# Altium schematic sheet Main.SchDoc
size A; SheetNumber: 2; SheetTotal: 3
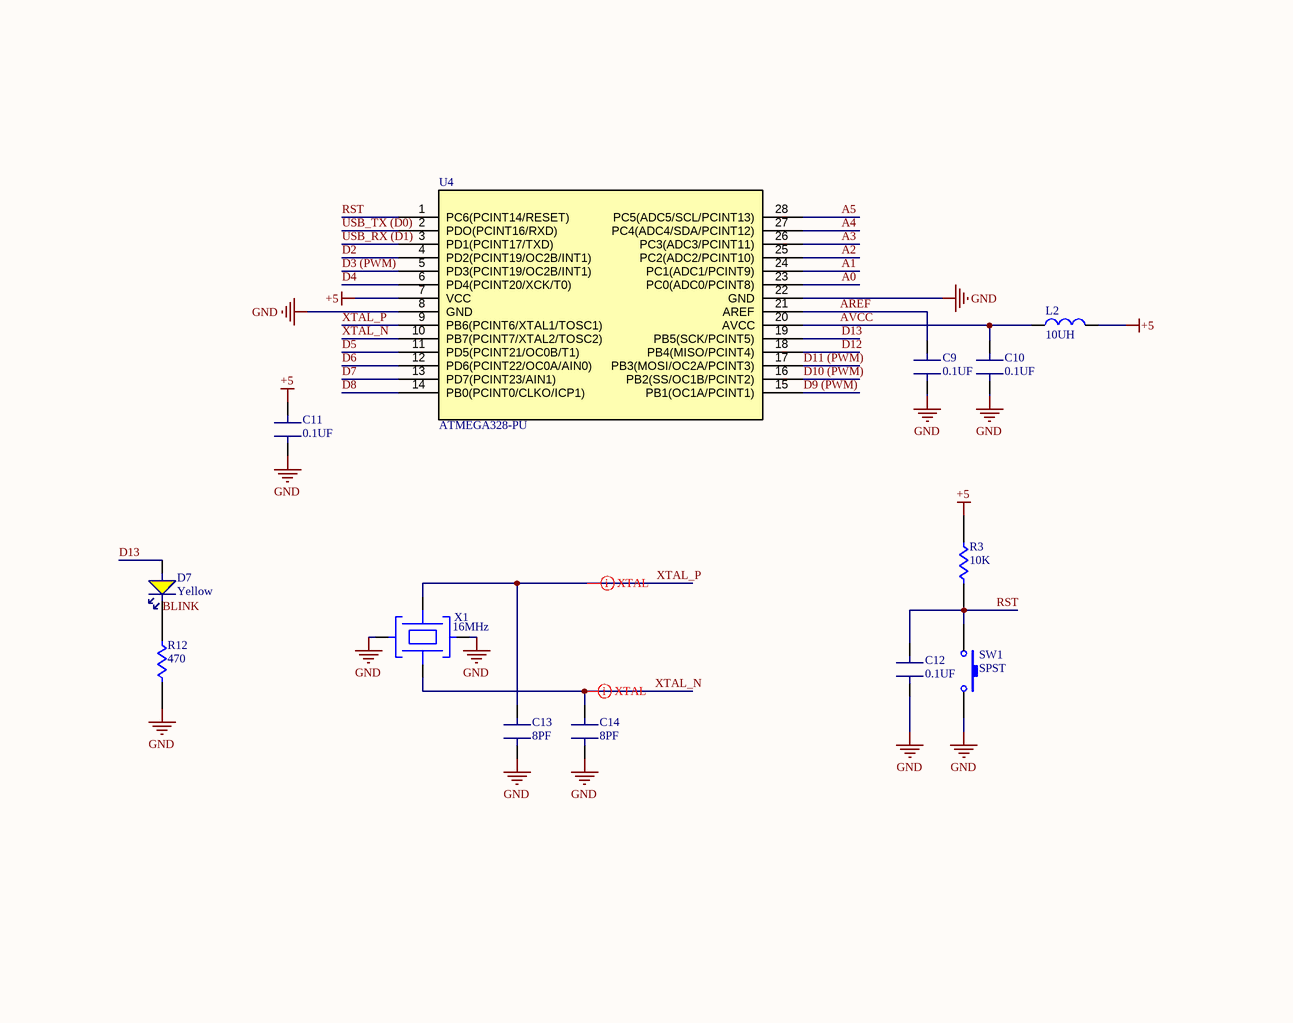
[diagram p0: Main.SchDoc]

## Parts
C9  0.1UF  [CAPC1608X90N]
C10  0.1UF  [CAPC1608X90N]
C11  0.1UF  [CAPC1608X90N]
C12  0.1UF  [CAP: 0603]
C13  8PF  [CAP: 0603]
C14  8PF  [CAP: 0603]
D7  Yellow  [LED: 0805Y]
L2  10UH  [IND: 1210]
R3  10K  [RESC1608X55N]
R12  470  [RESC1608X55N]
SW1  SPST  [MJTP1106STRB]
U4  ATMEGA328-PU  [dip_28]
X1  16MHz  [4-SMD, No Lead]

## Nets
+5: C11.1(A) L2.2(A) R3.2 U4.7(VCC)
GND: C9.2(B) C10.2(B) C11.2(B) C12.1(A) C13.1(A) C14.1(A) R12.1 SW1.1 U4.8(GND) U4.22(GND) X1.2 X1.4
A0: U4.23(PC0(ADC0/PCINT8))
A1: U4.24(PC1(ADC1/PCINT9))
A2: U4.25(PC2(ADC2/PCINT10))
A3: U4.26(PC3(ADC3/PCINT11))
A4: U4.27(PC4(ADC4/SDA/PCINT12))
A5: U4.28(PC5(ADC5/SCL/PCINT13))
AREF: C9.1(A) U4.21(AREF)
AVCC: C10.1(A) L2.1(A) U4.20(AVCC)
BLINK: D7.1(C) R12.2
D2: U4.4(PD2(PCINT19/OC2B/INT1))
D3 (PWM): U4.5(PD3(PCINT19/OC2B/INT1))
D4: U4.6(PD4(PCINT20/XCK/T0))
D5: U4.11(PD5(PCINT21/OC0B/T1))
D6: U4.12(PD6(PCINT22/OC0A/AIN0))
D7: U4.13(PD7(PCINT23/AIN1))
D8: U4.14(PB0(PCINT0/CLKO/ICP1))
D9 (PWM): U4.15(PB1(OC1A/PCINT1))
D10 (PWM): U4.16(PB2(SS/OC1B/PCINT2))
D11 (PWM): U4.17(PB3(MOSI/OC2A/PCINT3))
D12: U4.18(PB4(MISO/PCINT4))
D13: D7.2(A) U4.19(PB5(SCK/PCINT5))
RST: C12.2(B) R3.1 SW1.2 U4.1(PC6(PCINT14/RESET))
USB_RX (D1): U4.3(PD1(PCINT17/TXD))
USB_TX (D0): U4.2(PDO(PCINT16/RXD))
XTAL_N: C14.2(B) U4.10(PB7(PCINT7/XTAL2/TOSC2)) X1.3
XTAL_P: C13.2(B) U4.9(PB6(PCINT6/XTAL1/TOSC1)) X1.1

## Layout directives
differential pair: XTAL_N, XTAL_P

## Notes on the sheet
- DWG. NO.
- REV.
- SHT.
- THIS DOCUMENT AND THE DATA DISCLOSED HEREIN OR HEREWITH IS THE PROPERTY OF ALTIUM LIMITED AND MAY BE FREELY DISTRIBUTED IN WHOLE. NO RIGHTS ARE RESERVED OR EXPRESS OR IMPLIED WARANTEE GIVEN.
- REVISION
- DESCRIPTION
- DATE
- APPROVED
- ENG:
- APPROVALS
- PROJECT
- DSN:
- CHK:
- REFERENCE DOCUMENTS
- PROJECT REVISION:
- TITLE
- DOCUMENT REVISION:
- DESIGN ITEM:
- BOM:
- FAB DWG:
- PCB DWG:
- ASSY DWG:
- SCALE:
- SIZE
- B
- CAGE CODE
- FILE NAME
- DWG NO.
- SHEET
- OF
- REV

## Library data of the parts
C9-C12 = CC0603KRX7R9BB104: CAP CER 0.1UF 50V 10% X7R 0603; Supplier 1: Digi-Key; Supplier Part Number 1: 311-1344-1-ND
C13 C14 = CC0603DRNPO9BN8R0: CAP CER 8PF 50V C0G/NPO 0603; Supplier 1: Mouser; Supplier Part Number 1: 603-CC603DRNPO9BN8R0
D7 = 150080YS75000: LED YELLOW CLEAR 0805 SMD; Supplier 1: Mouser; Supplier Part Number 1: 710-150080YS75000
L2 = NLFV32T-100K-EF: FIXED IND 10UH 250MA 240MOHM SMD; Supplier 1: Mouser; Supplier Part Number 1: 810-NLFV32T-100K-EF
R3 = RC0603FR-0710KL: RES SMD 10K OHM 1% 1/10W 0603; Supplier 1: Mouser; Supplier Part Number 1: 603-RC0603FR-0710KL
R12 = 541-4055-6-ND: RES 470 OHM 5% 1/10W 0603; Supplier 1: Digi-Key; Supplier Part Number 1: 541-4055-1-ND
SW1 = MJTP1106STR: SWITCH TACTILE SPST-NO 0.05A 12V; Supplier 1: Digi-Key; Supplier Part Number 1: 679-2395-1-ND
U4 = ATMEGA328-PU: AVR AVR® ATmega Microcontroller IC 8-Bit 20MHz 32KB (16K x 16) FLASH 28-PDIP; Supplier 1: Mouser; Supplier Part Number 1: 556-ATMEGA328-PU
X1 = ECS-160-10-36-CKM-TR3: CRYSTAL 16.0000MHZ 10PF SMD; Supplier 1: Mouser; Supplier Part Number 1: 520-160-10-36CKM-TR3